# EAGLE design esquemático (EAGLE 9.6.2)
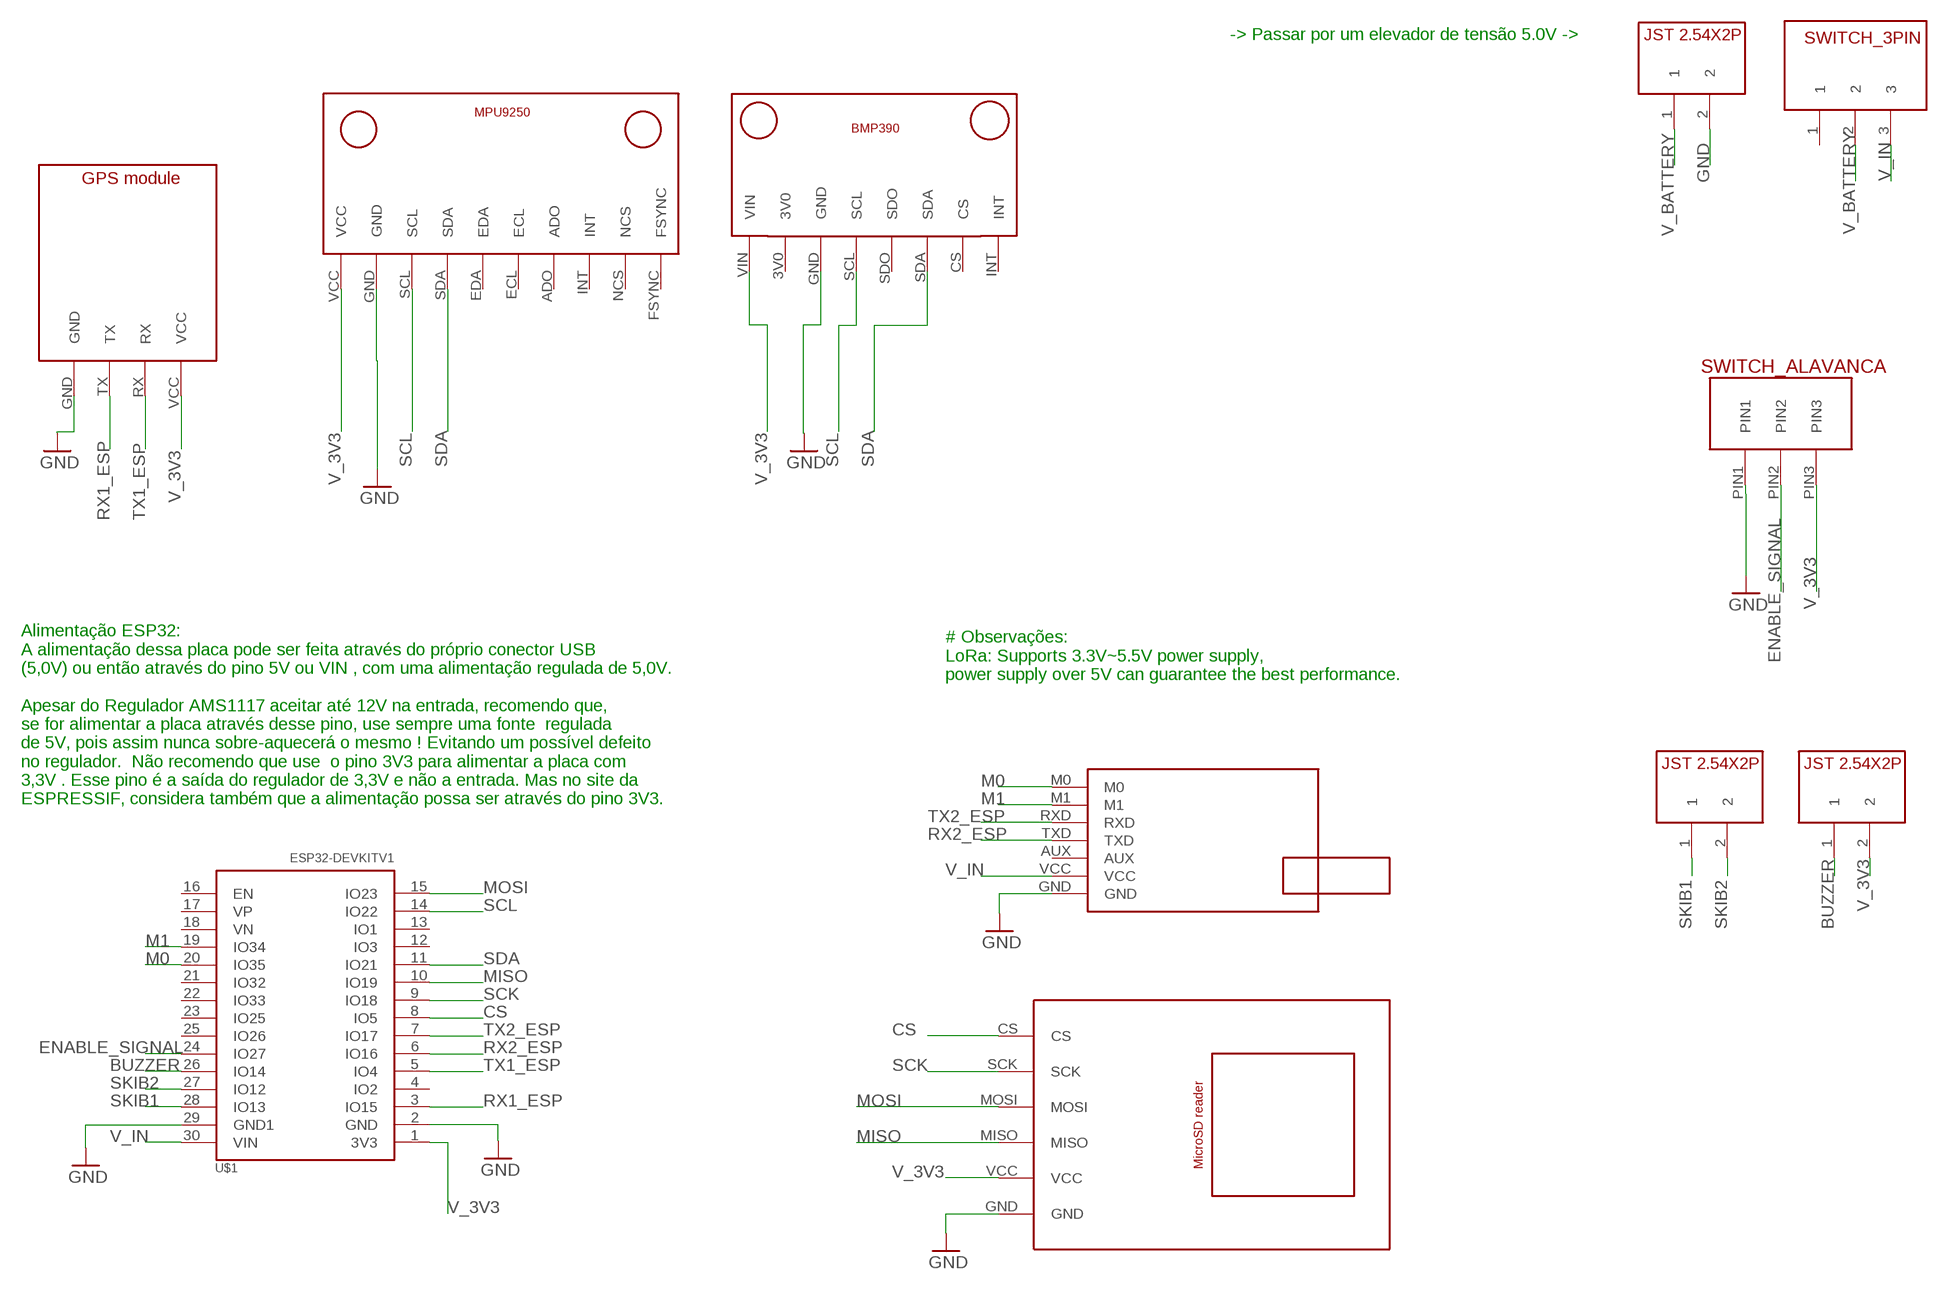
[diagram p0: schematic, sheet 1]

## Parts
U$1  ESP32DEVKITV1  [ESP32-DEVKITV1]
U$2  E22-400T30D  [E22-400T30D_FOOTPRINT]
U$3  GPS_MODULE  [GPS_MODULE_FOOTPRINT]
U$5  SWITCH_ALAVANCA  [SWITCH_ALAVANCA_FOOTPRINT]
U$7  MICROSD_READER  [MICROSD_READER_FOOTPRINT]
U$8  JST2.54X2P  [JST2.54X2P_FOOTPRINT]
U$9  JST2.54X2P  [JST2.54X2P_FOOTPRINT]
U$10  MPU9250V1  [MPU9250_FOOTPRINT]
U$11  SWITCH_3PIN  [SWITCH_3PIN]
U$12  JST2.54X2P  [JST2.54X2P_FOOTPRINT]
U$13  BMP390V1  [BMP390_FOOTPRINT]

## Nets
BUZZER: U$1.26(IO14) U$9.1
CS: U$1.8(IO5) U$7.CS
ENABLE_SIGNAL: U$1.24(IO27) U$5.PIN2
GND: U$1.2(GND) U$1.29(GND1) U$2.GND U$3.GND U$5.PIN1 U$7.GND U$10.GND U$12.2 U$13.GND
M0: U$1.20(IO35) U$2.M0
M1: U$1.19(IO34) U$2.M1
MISO: U$1.10(IO19) U$7.MISO
MOSI: U$1.15(IO23) U$7.MOSI
RX1_ESP: U$1.3(IO15) U$3.TX
RX2_ESP: U$1.6(IO16) U$2.TXD
SCK: U$1.9(IO18) U$7.SCK
SCL: U$1.14(IO22) U$10.SCL U$13.SCL
SDA: U$1.11(IO21) U$10.SDA U$13.SDA
SKIB1: U$1.28(IO13) U$8.1
SKIB2: U$1.27(IO12) U$8.2
TX1_ESP: U$1.5(IO4) U$3.RX
TX2_ESP: U$1.7(IO17) U$2.RXD
V_3V3: U$1.1(3V3) U$3.VCC U$5.PIN3 U$7.VCC U$9.2 U$10.VCC U$13.VIN
V_BATTERY: U$11.2 U$12.1
V_IN: U$1.30(VIN) U$2.VCC U$11.3
Unconnected: U$1.4(IO2) U$1.12(IO3) U$1.13(IO1) U$1.16(EN) U$1.17(VP) U$1.18(VN) U$1.21(IO32) U$1.22(IO33) U$1.23(IO25) U$1.25(IO26) U$2.AUX U$10.ADO U$10.ECL U$10.EDA U$10.FSYNC U$10.INT U$10.NCS U$11.1 U$13.3V0 U$13.CS U$13.INT U$13.SDO

## Notes on the sheet
- -> Passar por um elevador de tensão 5.0V ->
- # Observações:
  LoRa: Supports 3.3V~5.5V power supply, 
  power supply over 5V can guarantee the best performance.
- Alimentação ESP32:
  A alimentação dessa placa pode ser feita através do próprio conector USB
  (5,0V) ou então através do pino 5V ou VIN , com uma alimentação regulada de 5,0V.
  
  Apesar do Regulador AMS1117 aceitar até 12V na entrada, recomendo que,
  se for alimentar a placa através desse pino, use sempre uma fonte  regulada
  de 5V, pois assim nunca sobre-aquecerá o mesmo ! Evitando um possível defeito
  no regulador.  Não recomendo que use  o pino 3V3 para alimentar a placa com
  3,3V . Esse pino é a saída do regulador de 3,3V e não a entrada. Mas no site da
  ESPRESSIF, considera também que a alimentação possa ser através do pino 3V3.

## Library data of the parts
U$1 = ESP32-DEVKITV1:ESP32DEVKITV1
U$2 = CRD:E22-400T30D
U$3 = CRD:GPS_MODULE
U$5 = CRD:SWITCH_ALAVANCA
U$7 = CRD:MICROSD_READER: Leitor e gravador de cartão SD
U$8 U$9 U$12 = CRD:JST2.54X2P: Conector JST 2 pinos (2.54mm de distância entre pinos)
U$10 = CRD:MPU9250: Acelerômetro e Giroscópio
U$11 = CRD:SWITCH_3PIN
U$13 = CRD:BMP390: Sensor barométrico

## Board
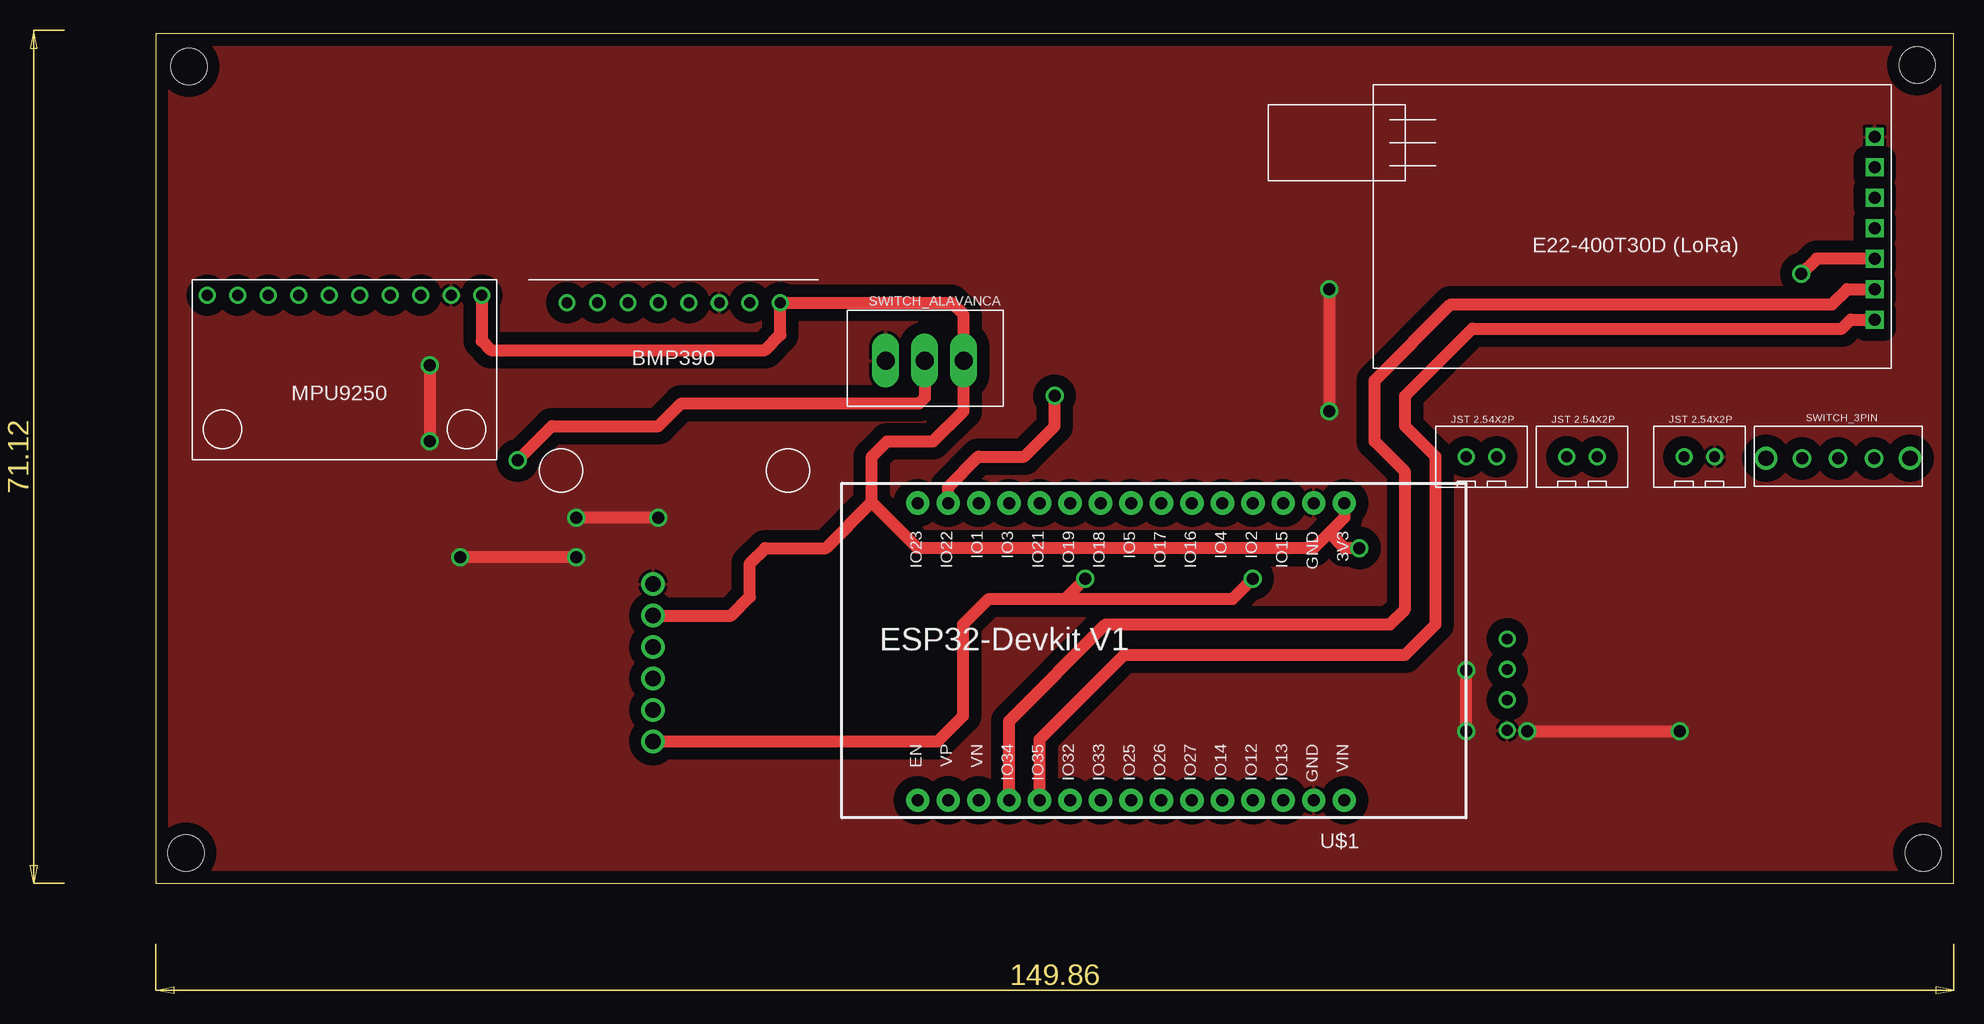
[diagram p1: board, top side]
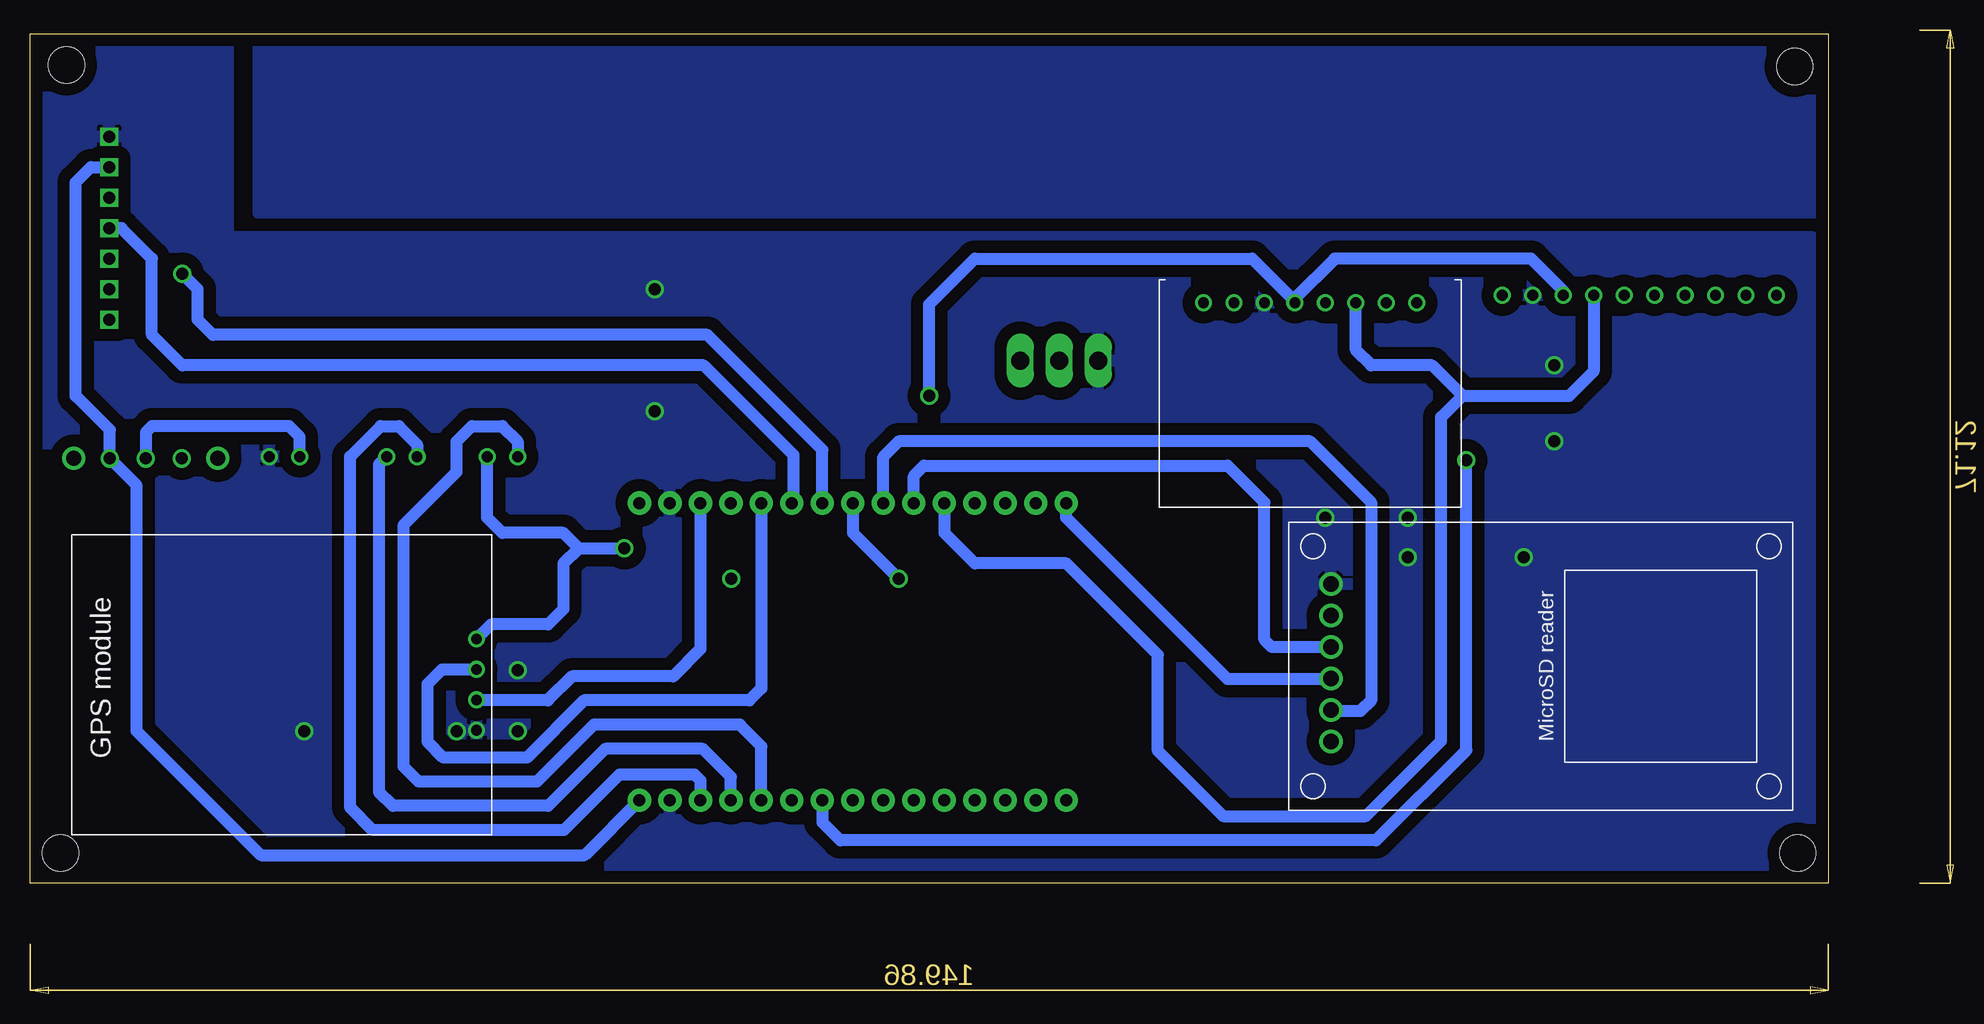
[diagram p2: board, bottom side, seen from below]

Size 149.84 x 70.79 mm. Coordinates in mm from the lower left corner, seen from the top.
Outline: 0,0 149.84,0 149.84,70.79 0,70.79 0,0
Copper layers (1*16): Top 0.035mm / dielectric 1.5mm / Bottom 0.035mm
Design rules "default *": minimum track width 1mm, minimum drill 0.35mm, track to track 40mil, track to pad 0.6mm, pad to pad 6mil, via to via 6mil, smd to smd 6mil, copper to edge 40mil, drill to drill 6mil, minimum pad ring 10mil, minimum via ring 8mil, stop-mask expansion 4mil, vias tented up to drill 0mil, thermal gap 10mil
Holes 3 mm at 2.79,68.07 2.54,2.54 147.32,2.54 146.81,68.2

### Footprints (pad centres in the part's own frame; a part is rotated, then mirrored left to right if it is on the bottom)
ESP32-DEVKITV1 = drill 1 pad 1.93: 1 -22.87,-13.54; 2 -20.33,-13.54; 3 -17.79,-13.54; 4 -15.25,-13.54; 5 -12.71,-13.54; 6 -10.17,-13.54; 7 -7.63,-13.54; 8 -5.09,-13.54; 9 -2.55,-13.54; 10 -0.01,-13.54; 11 2.53,-13.54; 12 5.07,-13.54; 13 7.61,-13.54; 14 10.15,-13.54; 15 12.69,-13.54; 16 12.69,11.23; 17 10.15,11.23; 18 7.61,11.23; 19 5.07,11.23; 20 2.53,11.23; 21 -0.01,11.23; 22 -2.55,11.23; 23 -5.09,11.23; 24 -7.63,11.23; 25 -10.17,11.23; 26 -12.71,11.23; 27 -15.25,11.23; 28 -17.79,11.23; 29 -20.33,11.23; 30 -22.87,11.23
E22-400T30D_FOOTPRINT = drill 1 square: AUX -16.383,-0.762; GND -16.383,-5.842; M0 -16.383,9.398; M1 -16.383,6.858; RXD -16.383,4.318; TXD -16.383,1.778; VCC -16.383,-3.302
GPS_MODULE_FOOTPRINT = drill 0.9: GND -4.01,-16.51; RX 1.07,-16.51; TX -1.47,-16.51; VCC 3.61,-16.51
SWITCH_ALAVANCA_FOOTPRINT = drill 1.5 long: PIN1 -3.302,-2.54; PIN2 -0.052,-2.54; PIN3 3.198,-2.54
MICROSD_READER_FOOTPRINT = drill 1.3: CS 6.449,-8.692; GND -6.651,-8.692; MISO -1.411,-8.692; MOSI 1.209,-8.692; SCK 3.829,-8.692; VCC -4.031,-8.692
JST2.54X2P_FOOTPRINT = drill 0.9: 1 -1.27,0; 2 1.27,0
MPU9250_FOOTPRINT = drill 0.9: ADO 3.81,-6.35; ECL 1.27,-6.35; EDA -1.27,-6.35; FSYNC 11.43,-6.35; GND -8.89,-6.35; INT 6.35,-6.35; NCS 8.89,-6.35; SCL -6.35,-6.35; SDA -3.81,-6.35; VCC -11.43,-6.35
SWITCH_3PIN = drill 1: 1 -3,-0.018; 2 0,-0.018; 3 3,-0.018 | drill 1.27: P$1 -6,0; P$2 6,0
BMP390_FOOTPRINT = drill 0.9: 3V0 -5.969,-8.382; CS 6.731,-8.382; GND -3.429,-8.382; INT 9.271,-8.382; SCL -0.889,-8.382; SDA 4.191,-8.382; SDO 1.651,-8.382; VIN -8.509,-8.382

### Placement (x,y rotation side)
U$1  76.2,18.16 180 top
U$2  126.87,56.39 180 top
U$3  129.16,16.76 90 bottom
U$5  64.14,46.1 0 top
U$7  32.77,18.29 270 bottom
U$8  118.87,35.56 0 top
U$9  110.49,35.56 0 top
U$10  15.75,42.67 180 top
U$11  140.21,35.43 0 top
U$12  128.65,35.56 0 top
U$13  43.56,40.01 180 top

### Tracks (layer width: path | path; a pad name or v marks a point on that pad's centre or on a via)
ANTENNA
  pour Bottom: 1.27,69.85 1.27,55.88 130.81,55.88 130.81,69.85
BUZZER
  Bottom 1: U$1.26 88.91,11.43 90.71,13.23 102.87,13.23 107.62,8.48 117.47,8.48 118.75,9.75 118.75,29.84 114.3,34.29 114.3,36.83 113.03,38.1 110.49,38.1 109.22,36.83 U$9.1
CS  (via drill 1)
  Top 1: 75.82,23.72 89.76,23.72 v91.44,25.4 | v77.47,25.4 77.47,25.37 75.82,23.72 | U$7.CS 65.18,11.84 67.31,13.97 67.31,21.59 69.44,23.72 75.82,23.72
  Bottom 1: U$1.8 81.29,29.22 v77.47,25.4
ENABLE_SIGNAL  (via drill 1)
  Top 1: v30.17,35.25 33.02,38.1 41.91,38.1 43.81,40.01 63.63,40.01 64.14,40.51 64.14,43.51 U$5.PIN2
  Bottom 1: U$1.24 83.83,5.09 82.33,3.59 37.7,3.59 30.17,11.12 v30.17,35.25
GND  (via drill 1)
  Top 1: v114.3,12.7 v127,12.7 | v109.22,12.7 v109.22,17.78 | v41.91,30.48 v35.05,30.48 | v22.86,43.18 v22.86,36.83 | v97.79,49.53 v97.79,39.37 | v35.05,27.18 v25.4,27.18
  pour Bottom: 1.27,53.85 133.35,53.85 133.35,69.85 148.59,69.85 148.59,1.27 1.27,1.27
  pour Top: 0,71.12 0,0 149.86,0 149.86,71.12
M0
  Top 1: U$1.20 73.67,12.01 80.71,19.05 104.14,19.05 106.68,21.59 106.68,35.56 104.14,38.1 104.14,40.64 109.74,46.24 140.53,46.24 141.28,46.99 U$2.M0
M1
  Top 1: U$2.M1 140.97,49.53 139.7,48.26 107.95,48.26 101.6,41.91 101.6,36.83 104.14,34.29 104.14,22.86 102.87,21.59 79.2,21.59 71.13,13.52 U$1.19
MISO
  Bottom 1: U$1.10 76.21,33.97 75.36,34.81 50.05,34.81 46.99,31.75 46.99,20.32 46.37,19.7 U$7.MISO
MOSI
  Bottom 1: U$1.15 63.51,30.49 50.05,17.03 41.5,17.03 U$7.MOSI
RX1_ESP
  Bottom 1: U$3.TX 112.61,15.26 106.7,15.26 104.69,17.27 96.27,17.27 93.99,19.54 U$1.3
RX2_ESP
  Bottom 1: U$2.TXD 142.24,54.61 139.7,52.07 139.7,45.72 137.16,43.18 93.73,43.18 86.23,35.69 86.23,31.84 U$1.6
SCK
  Bottom 1: U$1.9 78.75,35.55 77.47,36.83 43.18,36.83 38.1,31.75 38.1,15.24 38.99,14.35 41.35,14.35 U$7.SCK
SCL  (via drill 1)
  Top 1: U$1.14 66.05,33.03 68.58,35.56 72.39,35.56 74.93,38.1 v74.93,40.64
  Bottom 1: U$10.SCL 22.1,49.4 24.77,52.07 41.15,52.07 44.45,48.77 U$13.SCL 44.45,48.51 48.01,52.07 71.12,52.07 74.93,48.26 v74.93,40.64
SDA
  Bottom 1: U$1.11 73.67,29.22 71.12,26.67 63.5,26.67 55.88,19.05 55.88,11.05 50.44,5.6 38.53,5.6 32.26,11.88 32.26,38.86 30.48,40.64 | 30.48,40.64 21.59,40.64 19.56,42.67 U$10.SDA | U$13.SDA 39.37,44.45 38.1,43.18 33.02,43.18 30.48,40.64
SKIB1
  Bottom 1: U$8.1 117.6,36.58 119.13,38.1 120.65,38.1 123.19,35.56 123.19,6.35 121.28,4.45 105.37,4.45 100.72,9.09 94.5,9.09 93.99,8.58 U$1.28
SKIB2
  Bottom 1: U$1.27 91.45,8.89 93.78,11.22 101.92,11.22 106.68,6.46 119.62,6.46 120.78,7.62 120.78,34.92 U$8.2
TX1_ESP
  Bottom 1: U$1.5 88.91,16.25 89.92,15.25 103.7,15.25 108.46,10.49 115.41,10.49 116.73,11.81 116.73,16.62 115.52,17.83 U$3.RX
TX2_ESP  (via drill 1)
  Top 1: U$2.RXD 138.43,52.07 v137.16,50.8
  Bottom 1: v137.16,50.8 135.89,49.53 135.89,46.99 134.62,45.72 93.42,45.72 83.83,36.13 U$1.7
V_3V3  (via drill 1)
  Top 1: v100.33,27.94 99.06,27.94 97.79,29.21 | U$1.1 99.07,30.49 97.79,29.21 | 97.79,29.21 96.52,27.94 63.5,27.94 59.69,31.75 | U$7.VCC 47.97,22.32 49.53,23.88 49.53,26.67 50.8,27.94 55.88,27.94 59.69,31.75 | U$10.VCC 27.18,45.21 27.94,44.45 50.8,44.45 52.07,45.72 U$13.VIN 66.32,48.39 67.33,47.37 U$5.PIN3 67.33,39.37 67.31,39.37 64.77,36.83 60.96,36.83 59.69,35.56 59.69,31.75
  Bottom 1: U$9.2 111.76,30.48 110.49,29.21 105.41,29.21 104.14,27.94 | 104.14,27.94 105.41,26.67 105.41,22.86 106.68,21.59 111.43,21.59 U$3.VCC | 104.14,27.94 v100.33,27.94
V_BATTERY
  Bottom 1: U$12.1 127.38,37.21 128.27,38.1 139.7,38.1 140.21,37.59 U$11.2
V_IN
  Bottom 1: U$1.30 103.64,2.36 130.63,2.36 140.97,12.7 140.97,33.18 U$11.3 143.21,37.8 146.05,40.64 146.05,58.42 144.78,59.69 U$2.VCC